# EAGLE design v1 (EAGLE 7.7.0)
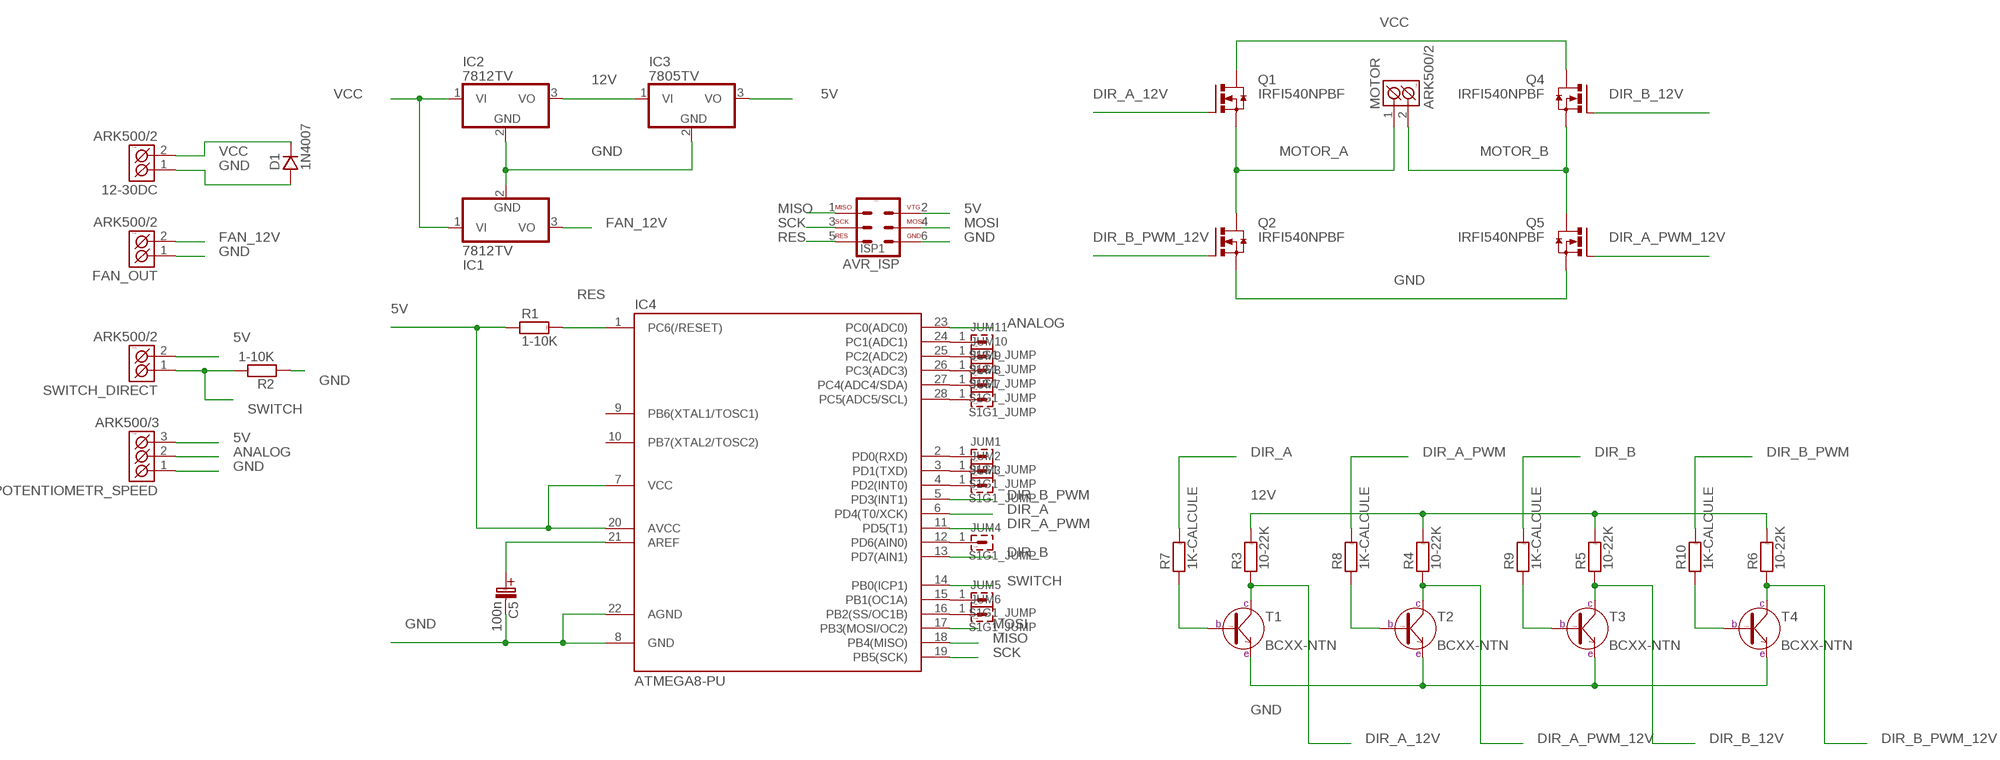
[diagram p0: schematic, sheet 1]

## Parts
12-30DC  ARK500/2  [ARK500/2]
C5  100n  C-EL_2,5  [C-EL_2,5]
D1  1N4007  [DO41]
FAN_OUT  ARK500/2  [ARK500/2]
IC1  7812TV  [TO220V]
IC2  7812TV  [TO220V]
IC3  7805TV  [TO220V]
IC4  ATMEGA8-PU  [DIL28-3]
ISP1  AVR_ISP  [MLW06G]
JUM1  S1G1_JUMP  [S1G1_JUM]
JUM2  S1G1_JUMP  [S1G1_JUM]
JUM3  S1G1_JUMP  [S1G1_JUM]
JUM4  S1G1_JUMP  [S1G1_JUM]
JUM5  S1G1_JUMP  [S1G1_JUM]
JUM6  S1G1_JUMP  [S1G1_JUM]
JUM7  S1G1_JUMP  [S1G1_JUM]
JUM8  S1G1_JUMP  [S1G1_JUM]
JUM9  S1G1_JUMP  [S1G1_JUM]
JUM10  S1G1_JUMP  [S1G1_JUM]
JUM11  S1G1_JUMP  [S1G1_JUM]
MOTOR  ARK500/2  [ARK500/2]
POTENTIOMETR_SPEED  ARK500/3  [ARK500/3]
Q1  IRFI540NPBF  [TO220BH]
Q2  IRFI540NPBF  [TO220BH]
Q4  IRFI540NPBF  [TO220BH]
Q5  IRFI540NPBF  [TO220BH]
R1  1-10K  R_7,5  [R-7,5]
R2  1-10K  R_7,5  [R-7,5]
R3  10-22K  R_7,5  [R-7,5]
R4  10-22K  R_7,5  [R-7,5]
R5  10-22K  R_7,5  [R-7,5]
R6  10-22K  R_7,5  [R-7,5]
R7  1K-CALCULE  R_7,5  [R-7,5]
R8  1K-CALCULE  R_7,5  [R-7,5]
R9  1K-CALCULE  R_7,5  [R-7,5]
R10  1K-CALCULE  R_7,5  [R-7,5]
SWITCH_DIRECT  ARK500/2  [ARK500/2]
T1  BCXX-NTN  BC546  [TO-92]
T2  BCXX-NTN  BC546  [TO-92]
T3  BCXX-NTN  BC546  [TO-92]
T4  BCXX-NTN  BC546  [TO-92]

## Nets
5V: IC3.3(VO) IC4.7(VCC) IC4.20(AVCC) ISP1.2 POTENTIOMETR_SPEED.3(K3) R1.1 SWITCH_DIRECT.2(K2)
12V: IC2.3(VO) IC3.1(VI) R3.2 R4.2 R5.2 R6.2
ANALOG: IC4.23(PC0(ADC0)) POTENTIOMETR_SPEED.2(K2)
DIR_A: IC4.6(PD4(T0/XCK)) R7.2
DIR_A_12V: Q1.G R3.1 T1.1(C)
DIR_A_PWM: IC4.11(PD5(T1)) R8.2
DIR_A_PWM_12V: Q5.G R4.1 T2.1(C)
DIR_B: IC4.13(PD7(AIN1)) R9.2
DIR_B_12V: Q4.G R5.1 T3.1(C)
DIR_B_PWM: IC4.5(PD3(INT1)) R10.2
DIR_B_PWM_12V: Q2.G R6.1 T4.1(C)
FAN_12V: FAN_OUT.2(K2) IC1.3(VO)
GND: 12-30DC.1(K1) C5.C-(C_EL-) D1.A FAN_OUT.1(K1) IC1.2(GND) IC2.2(GND) IC3.2(GND) IC4.8(GND) IC4.22(AGND) ISP1.6 POTENTIOMETR_SPEED.1(K1) Q2.S Q5.S R2.1 T1.3(E) T2.3(E) T3.3(E) T4.3(E)
MISO: IC4.18(PB4(MISO)) ISP1.1
MOSI: IC4.17(PB3(MOSI/OC2)) ISP1.4
MOTOR_A: MOTOR.1(K1) Q1.S Q2.D
MOTOR_B: MOTOR.2(K2) Q4.S Q5.D
N$1: IC4.2(PD0(RXD)) JUM1.1
N$2: IC4.3(PD1(TXD)) JUM2.1
N$3: IC4.4(PD2(INT0)) JUM3.1
N$4: IC4.12(PD6(AIN0)) JUM4.1
N$5: C5.C+(C_EL+) IC4.21(AREF)
N$6: R7.1 T1.2(B)
N$7: IC4.15(PB1(OC1A)) JUM5.1
N$8: IC4.16(PB2(SS/OC1B)) JUM6.1
N$9: R8.1 T2.2(B)
N$10: R9.1 T3.2(B)
N$11: R10.1 T4.2(B)
N$12: IC4.28(PC5(ADC5/SCL)) JUM7.1
N$13: IC4.27(PC4(ADC4/SDA)) JUM8.1
N$14: IC4.26(PC3(ADC3)) JUM9.1
N$15: IC4.25(PC2(ADC2)) JUM10.1
N$16: IC4.24(PC1(ADC1)) JUM11.1
RES: IC4.1(PC6(/RESET)) ISP1.5 R1.2
SCK: IC4.19(PB5(SCK)) ISP1.3
SWITCH: IC4.14(PB0(ICP1)) R2.2 SWITCH_DIRECT.1(K1)
VCC: 12-30DC.2(K2) D1.K IC1.1(VI) IC2.1(VI) Q1.D Q4.D
Unconnected: IC4.9(PB6(XTAL1/TOSC1)) IC4.10(PB7(XTAL2/TOSC2))

## Library data of the parts
12-30DC FAN_OUT MOTOR SWITCH_DIRECT = #PaJa_konektory:ARK500/2: Svorkovnice - roztec 5mm - dvojita
C5 = #PaJa_31:C-EL: Kondenzator - elektrolyticky
D1 = #PaJa_31:1N4007: Usmernovaci dioda - 1A, 1000V
IC1-IC3 = linear:78*: Positive VOLTAGE REGULATOR Source: http://cache.national.com/ds/LM/LM78L05.pdf http://www.fairchildsemi.com/ds/LM/LM7805.pdf
IC4 = atmega8:ATMEGA8-PU
ISP1 = #PaJa_31:AVR_ISP: AVR ISP konektor (dle standardu)
JUM1-JUM11 = #PaJa_konektory:S1G1_JUMP: Radove konektory - koliky - 1x
POTENTIOMETR_SPEED = #PaJa_konektory:ARK500/3: Svorkovnice - roztec 5mm - trojita
Q1 Q2 Q4 Q5 = transistor-power:IRFI540NPBF: HEXFET Power MOISFET VDSS = 100V, RDS(on) = 0.052 Ohm, ID = 20A, VGS(th) = 2.0 -- 4.0V Source: http://www.irf.com/product-info/datasheets/data/irfi540npbf.pdf
R1-R10 = #PaJa_31:R: Rezistor
T1-T4 = #PaJa_31:BC546: Tranzistor NPN - Univerzalni NF - Ic=0,1A

## Board
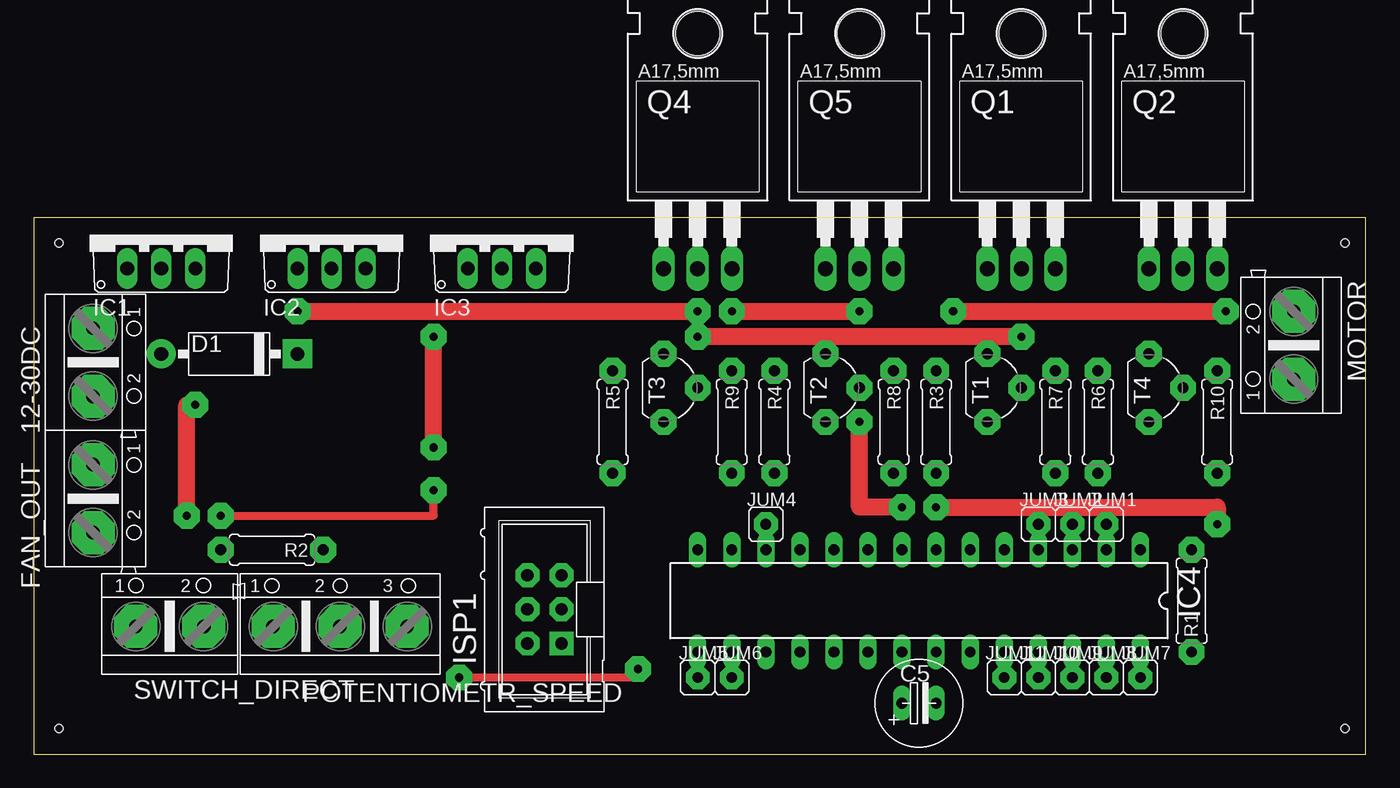
[diagram p1: board, top side]
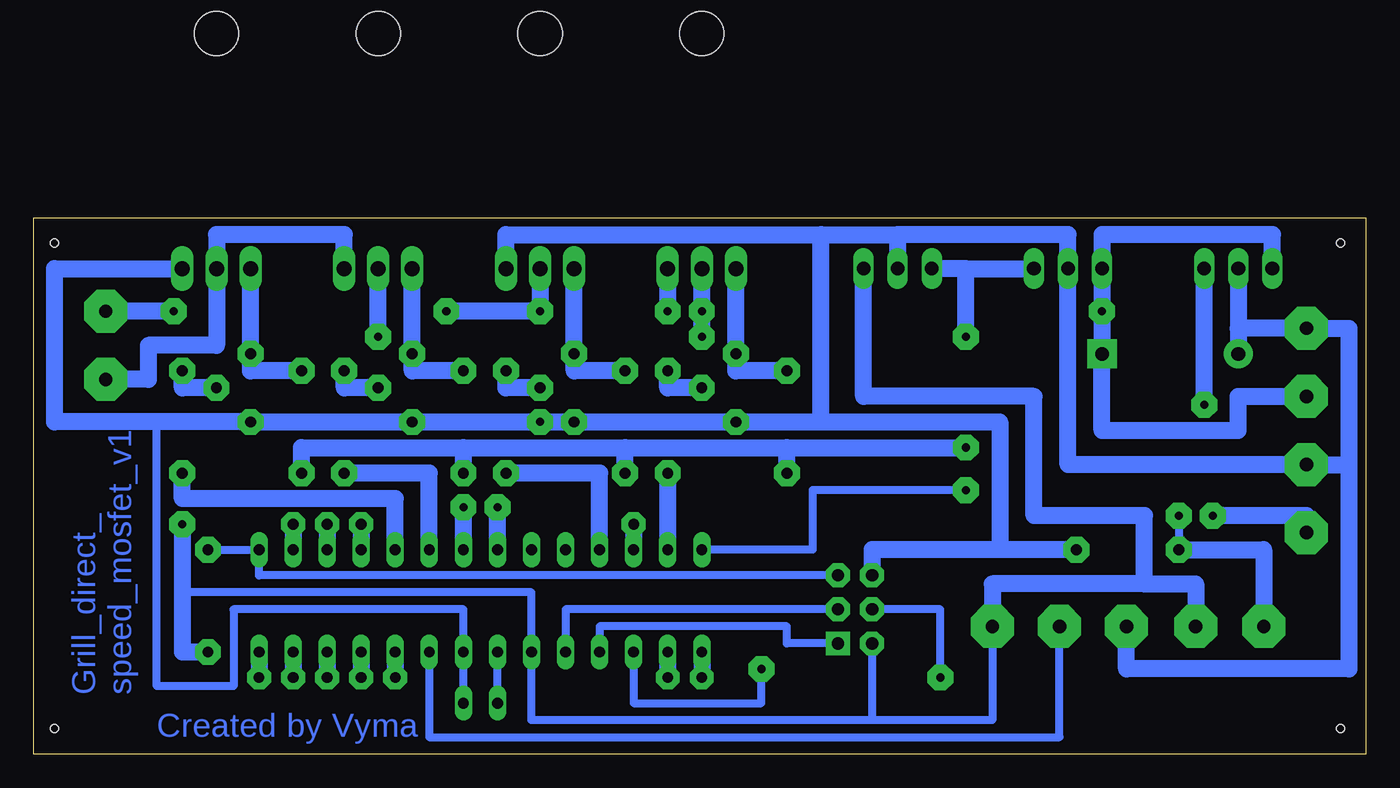
[diagram p2: board, bottom side, seen from below]

Size 99.36 x 39.99 mm. Coordinates in mm from the lower left corner, seen from the top.
Outline: 0,0 99.36,0 99.36,39.99 0,39.99 0,0
Copper layers (1*16): Top 0.035mm / dielectric 1.5mm / Bottom 0.035mm
Design rules "default": minimum track width 10mil, minimum drill 24mil, track to track 8mil, track to pad 8mil, pad to pad 8mil, via to via 8mil, smd to smd 8mil, copper to edge 40mil, drill to drill 8mil, minimum pad ring 10mil, minimum via ring 8mil, stop-mask expansion 4mil, vias tented up to drill 0mil, thermal gap 10mil
Holes 0.6 mm at 1.91,38.1 97.79,1.91 97.79,38.1 1.91,1.91

### Footprints (pad centres in the part's own frame; a part is rotated, then mirrored left to right if it is on the bottom)
ARK500/2 = drill 1 pad 3.2 octagon: 1 -2.54,0; 2 2.54,0
C-EL_2,5 = drill 0.813 pad 1.27 long: C+ -1.27,0; C- 1.27,0
DO41 = drill 1.016 pad 2.184: A -5.08,0 | drill 1.016 pad 2.184 square: K 5.08,0
TO220V = drill 1.016 long: 1 -2.54,-2.54; 2 0,-2.54; 3 2.54,-2.54
DIL28-3 = drill 0.813 long: 1 -16.51,-3.81; 2 -13.97,-3.81; 3 -11.43,-3.81; 4 -8.89,-3.81; 5 -6.35,-3.81; 6 -3.81,-3.81; 7 -1.27,-3.81; 8 1.27,-3.81; 9 3.81,-3.81; 10 6.35,-3.81; 11 8.89,-3.81; 12 11.43,-3.81; 13 13.97,-3.81; 14 16.51,-3.81; 15 16.51,3.81; 16 13.97,3.81; 17 11.43,3.81; 18 8.89,3.81; 19 6.35,3.81; 20 3.81,3.81; 21 1.27,3.81; 22 -1.27,3.81; 23 -3.81,3.81; 24 -6.35,3.81; 25 -8.89,3.81; 26 -11.43,3.81; 27 -13.97,3.81; 28 -16.51,3.81
MLW06G = drill 0.914 pad 1.778 square: 1 -2.54,-1.27 | drill 0.914 pad 1.778 octagon: 2 -2.54,1.27; 3 0,-1.27; 4 0,1.27; 5 2.54,-1.27; 6 2.54,1.27
S1G1_JUM = drill 0.8 pad 1.778 octagon: 1 0,0
ARK500/3 = drill 1 pad 3.2 octagon: 1 -5,0; 2 0,0; 3 5,0
TO220BH = drill 1.118 long: D 0,-6.35; G -2.54,-6.35; S 2.54,-6.35 | hole 3.302: 0,11.176
R-7,5 = drill 0.813 pad 1.93 octagon: 1 -3.81,0; 2 3.81,0
TO-92 = drill 0.813 pad 1.93 octagon: 1 0,2.54; 2 2.54,0; 3 0,-2.54

### Placement (x,y rotation side)
12-30DC  4.45,29.21 270 top
C5  66.04,3.81 0 top
D1  14.61,29.84 0 top
FAN_OUT  4.45,19.05 270 top
IC1  9.53,38.73 0 top
IC2  22.23,38.73 0 top
IC3  34.92,38.73 0 top
IC4  66.04,11.43 180 top
ISP1  38.1,10.79 90 top
JUM1  80.01,17.14 0 top
JUM2  77.47,17.14 0 top
JUM3  74.93,17.14 0 top
JUM4  54.61,17.14 0 top
JUM5  49.53,5.71 0 top
JUM6  52.07,5.71 0 top
JUM7  82.55,5.71 0 top
JUM8  80.01,5.71 0 top
JUM9  77.47,5.71 0 top
JUM10  74.93,5.71 0 top
JUM11  72.39,5.71 0 top
MOTOR  93.98,30.48 90 top
POTENTIOMETR_SPEED  22.86,9.53 0 top
Q1  73.66,42.55 0 top
Q2  85.72,42.55 0 top
Q4  49.53,42.55 0 top
Q5  61.59,42.55 0 top
R1  86.36,11.43 90 top
R2  17.78,15.24 180 top
R3  67.31,24.77 270 top
R4  55.24,24.77 270 top
R5  43.18,24.77 270 top
R6  79.38,24.77 270 top
R7  76.2,24.77 270 top
R8  64.14,24.77 270 top
R9  52.07,24.77 270 top
R10  88.27,24.77 270 top
SWITCH_DIRECT  10.16,9.53 0 top
T1  71.12,27.3 0 top
T2  59.05,27.3 0 top
T3  46.99,27.3 0 top
T4  83.19,27.3 0 top

### Tracks (layer width: path | path; a pad name or v marks a point on that pad's centre or on a via)
5V  (via drill 0.6 pad 1.93)
  Top 1.27: v67.31,18.41 88.27,18.41 v88.27,17.14
  Bottom 0.61: ISP1.2 36.83,2.54 | 36.83,2.54 62.23,2.54 IC4.20 62.23,12.06 88.27,12.06 | POTENTIOMETR_SPEED.3 27.86,2.54 36.83,2.54
  Bottom 1.27: 16.51,12.7 16.51,17.78 24.77,17.78 24.77,26.67 37.47,26.67 IC3.3 | 16.51,12.7 27.86,12.7 POTENTIOMETR_SPEED.3 | IC4.7 v67.31,18.41 | v88.27,17.14 88.27,12.06 88.27,7.62 R1.1 | 16.51,12.7 12.7,12.7 SWITCH_DIRECT.2
12V  (via drill 0.6 pad 1.93)
  Top 1.27: v29.84,22.86 v29.84,31.11
  Bottom 1.27: R6.2 79.38,22.86 67.31,22.86 | R3.2 67.31,22.86 | 67.31,22.86 55.24,22.86 | R4.2 55.24,22.86 | 55.24,22.86 43.18,22.86 | R5.2 43.18,22.86 | 43.18,22.86 v29.84,22.86 | v29.84,31.11 29.84,36.2 | 29.84,36.2 IC2.3 | 29.84,36.2 IC3.1
ANALOG
  Bottom 0.61: IC4.23 69.85,1.27 22.86,1.27 POTENTIOMETR_SPEED.2
DIR_A
  Bottom 1.27: IC4.6 69.85,20.95 R7.2
DIR_A_12V
  Bottom 1.27: R3.1 71.12,28.57 T1.1 Q1.G
DIR_A_PWM
  Bottom 1.27: IC4.11 57.15,20.95 R8.2
DIR_A_PWM_12V
  Bottom 1.27: R4.1 59.05,28.57 T2.1 Q5.G
DIR_B
  Bottom 1.27: R9.2 IC4.13
DIR_B_12V
  Bottom 1.27: R5.1 46.99,28.57 T3.1 Q4.G
DIR_B_PWM
  Bottom 1.27: IC4.5 72.39,19.05 88.27,19.05 R10.2
DIR_B_PWM_12V
  Bottom 1.27: R6.1 83.19,28.57 T4.1 Q2.G
FAN_12V  (via drill 0.6 pad 1.93)
  Top 1.27: v11.43,17.78 11.43,26.04 v12.06,26.04
  Bottom 1.27: FAN_OUT.2 4.45,17.78 v11.43,17.78 | v12.06,26.04 IC1.3
GND  (via drill 0.6 pad 1.93)
  Top 1.27: v64.77,18.41 61.59,18.41 v61.59,24.77
  Bottom 0.61: C5.C- IC4.22 67.31,10.79 84.45,10.79 84.45,5.08 90.17,5.08 90.17,24.77
  Bottom 1.27: IC1.2 9.53,31.75 | 9.53,31.75 D1.A | 9.53,31.75 12-30DC.1 1.27,31.75 1.27,21.59 | 1.27,21.59 1.27,6.35 17.86,6.35 POTENTIOMETR_SPEED.1 | 1.27,21.59 FAN_OUT.1 22.23,21.59 IC2.2 22.23,38.73 34.92,38.73 | 34.92,38.73 IC3.2 | Q5.S 64.14,38.73 40.64,38.73 | 40.64,38.73 34.92,38.73 | 40.64,24.77 T3.3 T2.3 v61.59,24.77 T1.3 T4.3 90.17,24.77 97.79,24.77 97.79,36.2 Q2.S | 40.64,24.77 40.64,38.73 | 40.64,24.77 27.3,24.77 27.3,15.24 | IC4.8 v64.77,18.41 | R2.1 27.3,15.24 | 27.3,15.24 36.83,15.24 ISP1.6
MISO
  Bottom 0.61: IC4.18 57.15,9.53 43.18,9.53 43.18,8.26 ISP1.1
MOSI  (via drill 0.6 pad 1.93)
  Top 0.61: v45.09,6.35 44.45,5.71 v31.75,5.71
  Bottom 0.61: IC4.17 54.61,3.81 45.09,3.81 v45.09,6.35 | v31.75,5.71 31.75,10.79 ISP1.4
MOTOR_A
  Bottom 1.27: Q1.S 76.2,38.73 85.72,38.73 Q2.D 85.72,30.48 90.81,30.48 90.81,27.94 MOTOR.1
MOTOR_B  (via drill 0.6 pad 1.93)
  Top 1.27: v52.07,33.02 v61.59,33.02 | v68.58,33.02 v88.9,33.02
  Bottom 1.27: Q4.S v52.07,33.02 | Q5.D v61.59,33.02 v68.58,33.02 | v88.9,33.02 MOTOR.2 94.61,33.02
N$1
  Bottom 1.27: JUM1.1 IC4.2
N$2
  Bottom 1.27: JUM2.1 IC4.3
N$3
  Bottom 1.27: JUM3.1 IC4.4
N$4
  Bottom 1.27: JUM4.1 IC4.12
N$5
  Bottom 0.61: C5.C+ IC4.21
N$6
  Bottom 1.27: T1.2 76.2,27.3 R7.1
N$7
  Bottom 1.27: IC4.15 JUM5.1
N$8
  Bottom 1.27: IC4.16 JUM6.1
N$9
  Bottom 1.27: T2.2 64.14,27.3 R8.1
N$10
  Bottom 1.27: T3.2 52.07,27.3 R9.1
N$11
  Bottom 1.27: T4.2 88.27,27.3 R10.1
N$12
  Bottom 1.27: IC4.28 JUM7.1
N$13
  Bottom 1.27: IC4.27 JUM8.1
N$14
  Bottom 1.27: IC4.26 JUM9.1
N$15
  Bottom 1.27: IC4.25 JUM10.1
N$16
  Bottom 1.27: IC4.24 JUM11.1
RES
  Bottom 0.61: ISP1.5 82.55,13.34 IC4.1 R1.2
SCK
  Bottom 0.61: ISP1.3 59.69,10.79 IC4.19
SWITCH  (via drill 0.6 pad 1.93)
  Top 0.61: v13.97,17.78 29.84,17.78 v29.84,19.68
  Bottom 0.61: v13.97,17.78 R2.2 | v29.84,19.68 41.27,19.68 41.27,15.24 IC4.14
  Bottom 1.27: R2.2 7.62,15.24 SWITCH_DIRECT.1
VCC  (via drill 0.6 pad 1.93)
  Top 1.27: v19.68,33.02 v49.53,33.02 | v73.66,31.11 v49.53,31.11
  Bottom 1.27: IC1.1 6.99,38.73 19.68,38.73 IC2.1 v19.68,33.02 D1.K 19.68,24.13 9.53,24.13 9.53,26.67 12-30DC.2 | Q4.D v49.53,33.02 v49.53,31.11 | v73.66,31.11 Q1.D

### Text on the board
Bottom: Grill_direct_ / speed_mosfet_v1 | Created by Vyma